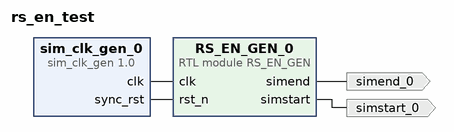
[diagram p0: block diagram of the top level]
# Vivado block design rs_en_test, xc7z020clg400-3, Vivado 2018.3
create_bd_design rs_en_test

create_bd_port -dir O simend_0
create_bd_port -dir O simstart_0

create_bd_cell -type ip -vlnv xilinx.com:ip:sim_clk_gen:1.0 sim_clk_gen_0
set_property -dict {CONFIG.INITIAL_RESET_CLOCK_CYCLES 1000} [get_bd_cells sim_clk_gen_0]
create_bd_cell -type module -reference RS_EN_GEN RS_EN_GEN_0

# ---- connections ----

connect_bd_net [get_bd_pins sim_clk_gen_0/clk] [get_bd_pins RS_EN_GEN_0/clk]
connect_bd_net [get_bd_pins sim_clk_gen_0/sync_rst] [get_bd_pins RS_EN_GEN_0/rst_n]
connect_bd_net [get_bd_pins RS_EN_GEN_0/simend] [get_bd_ports simend_0]
connect_bd_net [get_bd_pins RS_EN_GEN_0/simstart] [get_bd_ports simstart_0]

validate_bd_design
save_bd_design
